# Altium schematic sheet POWER_3.3V_6A.SchDoc
size A4
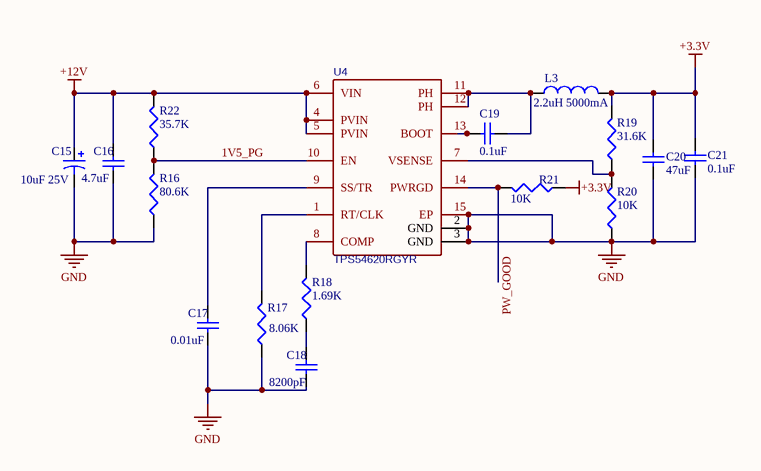
[diagram p0: POWER_3.3V_6A.SchDoc]

## Parts
C15  value 10uF 25V  [47UF_16V]  (hidden comment: Cap Pol1)
C16  value 4.7uF  [C1210]  (hidden comment: Cap Semi)
C17  value 0.01uF  [C1210]  (hidden comment: Cap Semi)
C18  value 8200pF  [C1210]  (hidden comment: Cap Semi)
C19  value 0.1uF  [C1210]  (hidden comment: Cap Semi)
C20  value 47uF  [C1210]  (hidden comment: Cap Semi)
C21  value 0.1uF  [C1210]  (hidden comment: Cap Semi)
L3  value 2.2uH 5000mA  [IND-SMD_L5.5-W5.2]  (hidden comment: Inductor)
R16  value 80.6K  [J1-0603]  (hidden comment: Res3)
R17  value 8.06K  [J1-0603]  (hidden comment: Res3)
R18  value 1.69K  [J1-0603]  (hidden comment: Res3)
R19  value 31.6K  [J1-0603]  (hidden comment: Res3)
R20  value 10K  [J1-0603]  (hidden comment: Res3)
R21  value 10K  [J1-0603]  (hidden comment: Res3)
R22  value 35.7K  [J1-0603]  (hidden comment: Res3)
U4  TPS54620RGYR  [VQFN-14_L3.5-W3.5-P0.50-TL-EP_TPS54622RHLT]

## Nets
+3.3V: C20.1 C21.1 L3.2 R19.2 R21.1
+12V: C15.1 C16.2 R22.2 U4.4(PVIN) U4.5(PVIN) U4.6(VIN)
GND: C15.2 C16.1 C17.1 C18.1 C20.2 C21.2 R16.1 R17.1 R20.1 U4.2(GND) U4.3(GND) U4.15(EP)
1V5_PG: R16.2 R22.1 U4.10(EN)
PW_GOOD: R21.2 U4.14(PWRGD)
NetC17_2: C17.2 U4.9(SS/TR)
NetC18_2: C18.2 R18.1
NetC19_1: C19.1 L3.1 U4.11(PH) U4.12(PH)
NetC19_2: C19.2 U4.13(BOOT)
NetR17_2: R17.2 U4.1(RT/CLK)
NetR18_2: R18.2 U4.8(COMP)
NetR19_1: R19.1 R20.2 U4.7(VSENSE)

## Library data of the parts
C15 = Cap Pol1: Polarized Capacitor (Radial); Published: 8-Jun-2000; LatestRevisionDate: 17-Jul-2002; LatestRevisionNote: Re-released for DXP Platform.; PackageReference: RB7.6-15; Publisher: Altium Limited; PackageDescription: Polarized Capacitor (Radial); 2 Leads
C16-C21 = Cap Semi: Capacitor (Semiconductor SIM Model); Published: 8-Jun-2000; LatestRevisionDate: 29-May-2009; LatestRevisionNote: IPC-7351 Footprint Added.; PackageReference: C1206; Publisher: Altium Limited; PackageDescription: Chip Capacitor
L3 = Inductor: Code_IEC: 1005; Published: 8-Jun-2000; LatestRevisionDate: 29-May-2009; LatestRevisionNote: IPC-7351 Footprint Added.; PackageReference: 0402-A; Publisher: Altium Limited; PackageDescription: Chip Inductor; Code_JEITA: 0402
R16-R22 = Res3: Resistor; Published: 8-Jun-2000; LatestRevisionDate: 29-May-2009; LatestRevisionNote: IPC-7351 Footprint Added.; PackageReference: J1-0603; Publisher: Altium Limited; PackageDescription: Chip Resistor
U4 = TPS54620RGYR: BOM_Manufacturer: TI; BOM_Supplier: LCSC; BOM_Manufacturer Part: TPS54620RGYR; image: //image.lceda.cn/szlcsc/C29438.jpg; BOM_Supplier Part: C29438; spicePre: U; spiceSymbolName: TPS54620RGYR